# Altium schematic sheet main.SchDoc
size A3; SheetNumber: 1; SheetTotal: 2
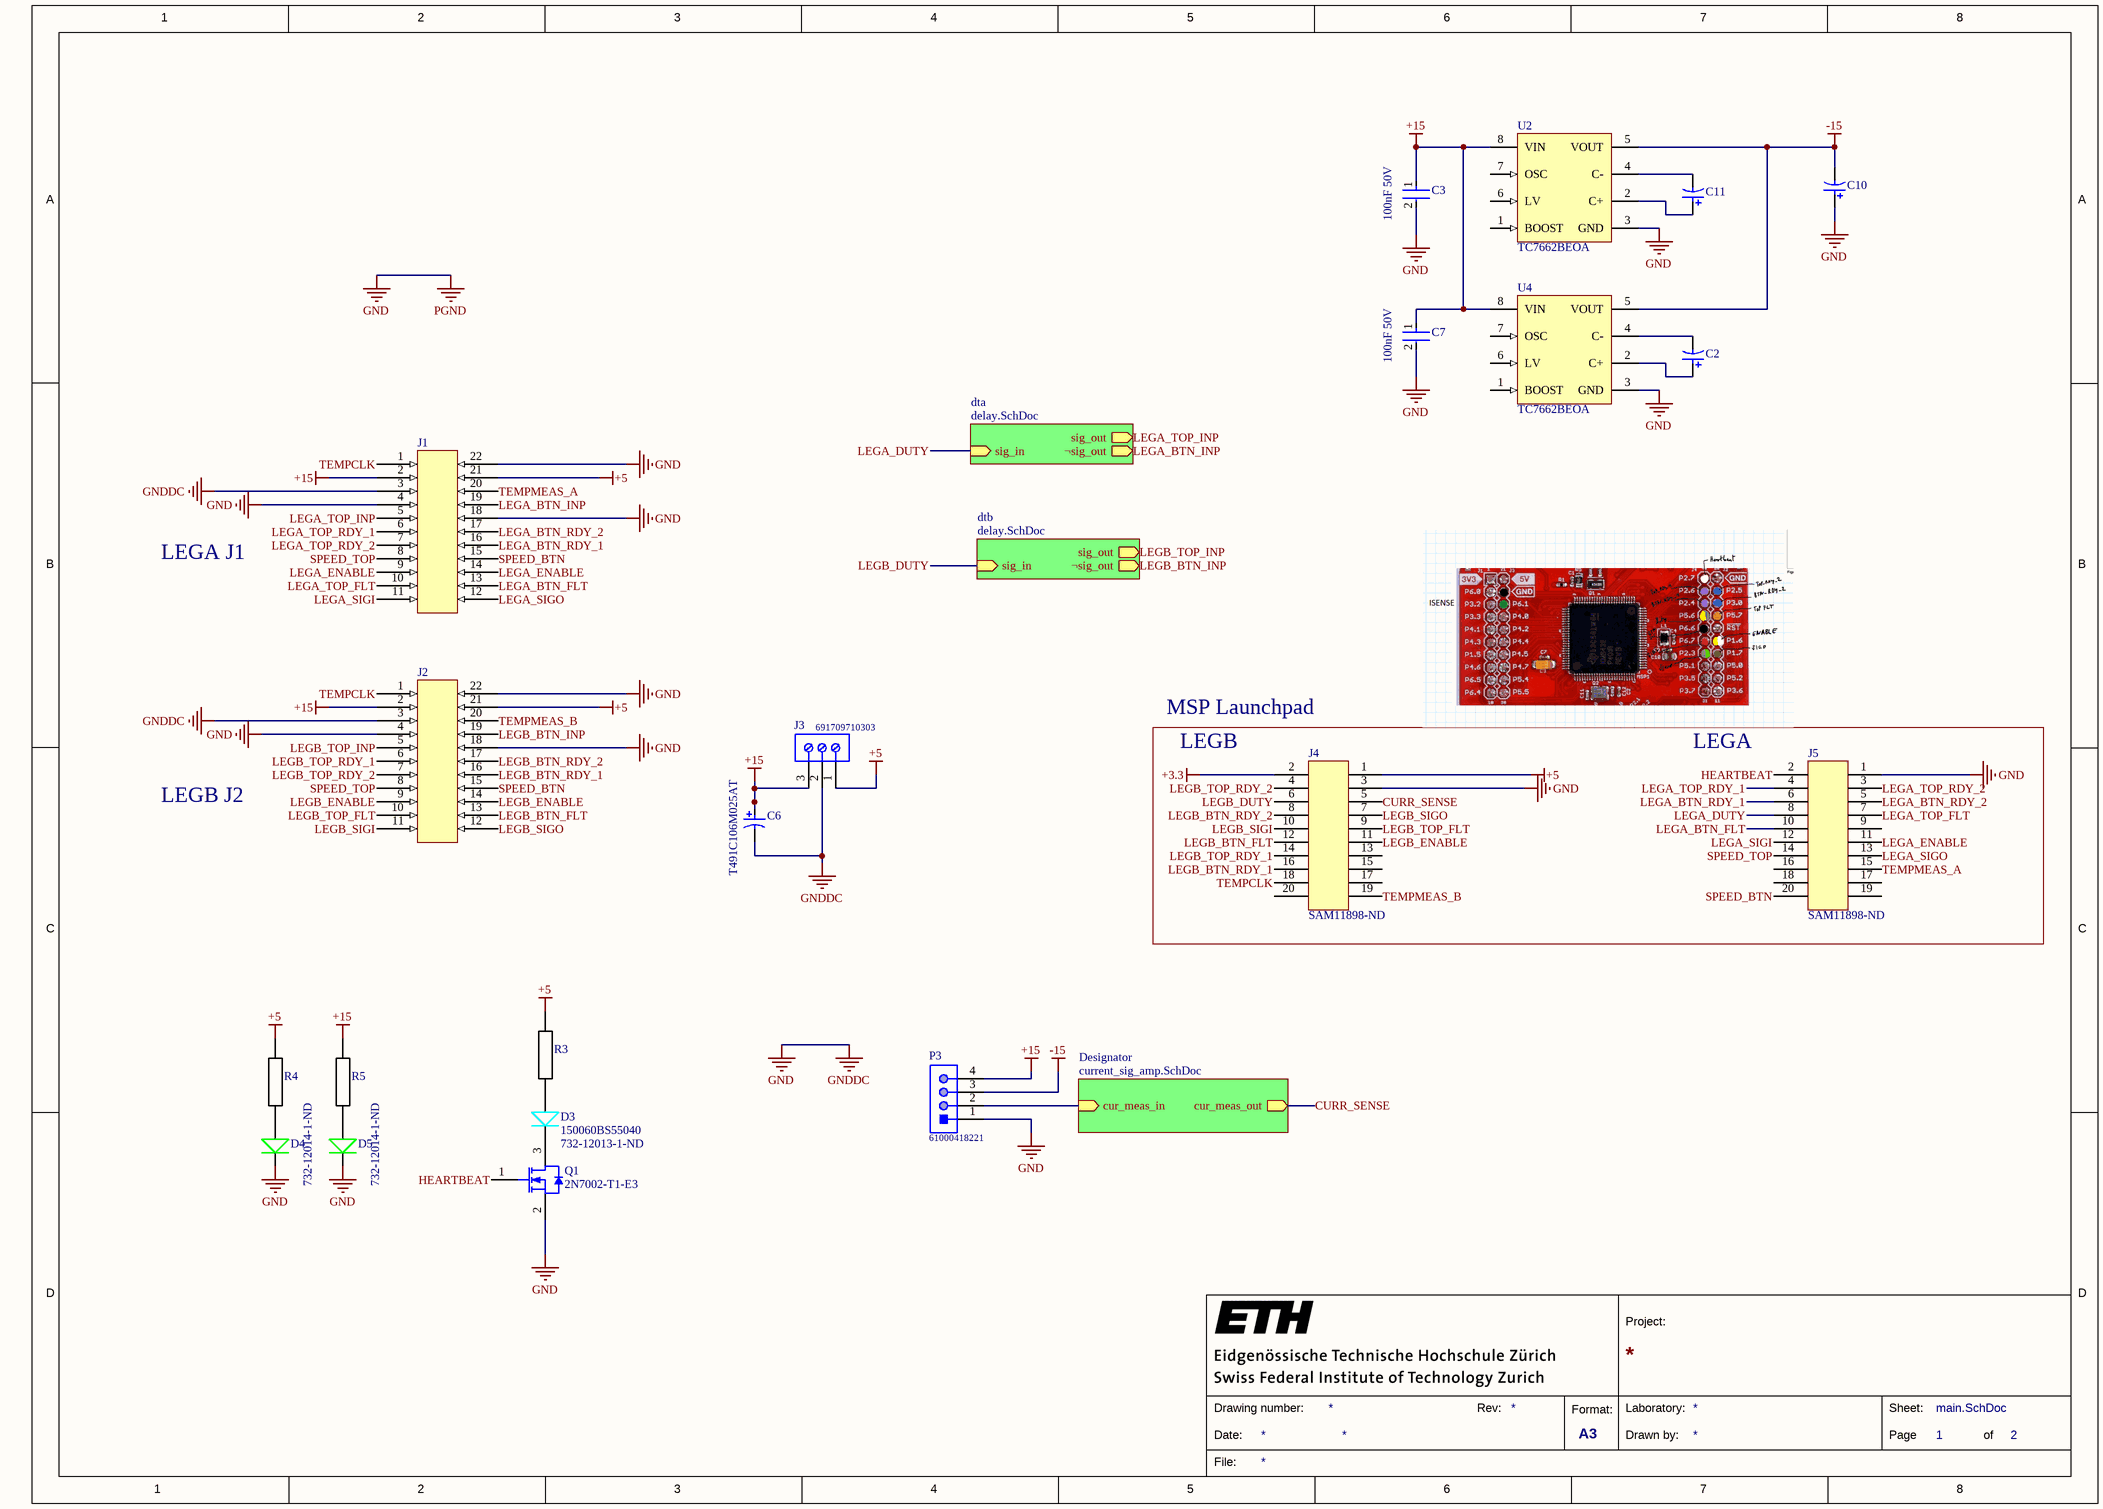
[diagram p0: main.SchDoc]

## Parts
C2  TPSD226M025R0200  [AVX-7343-31_L]  (value not drawn)
C3  100nF 50V  [FP-CGA3E-0_3-0_1-IPC_A]
C6  T491C106M025AT  [KEMT-T491-C_L]
C7  100nF 50V  [FP-CGA3E-0_3-0_1-IPC_A]
C10  TPSD226M025R0200  [AVX-7343-31_L]  (value not drawn)
C11  TPSD226M025R0200  [AVX-7343-31_L]  (value not drawn)
D3  150060BS55040  Supplier Part Number 1: 732-12013-1-ND  [LED_BLUE_0603]
D4  732-12014-1-ND  [LED_GREEN_0603]
D5  732-12014-1-ND  [LED_GREEN_0603]
J1  header_22_milligrid  [header_22_milligrid]  (value not drawn)
J2  header_22_milligrid  [header_22_milligrid]  (value not drawn)
J3  691709710303  [691709710303]
J4  Supplier Part Number 1: SAM11898-ND  [header_f_20_imp]  (hidden comment: header_f_20_imp)
J5  Supplier Part Number 1: SAM11898-ND  [header_f_20_imp]  (hidden comment: header_f_20_imp)
P3  61000418221  [61000418221]
Q1  2N7002-T1-E3  [VISH-TO-236-3_A_L]
R3  res_smd  [0805]  (value not drawn)
R4  res_smd  [0805]  (value not drawn)
R5  res_smd  [0805]  (value not drawn)
U2  TC7662BEOA  [SOIC-OA8_M]
U4  TC7662BEOA  [SOIC-OA8_M]

## Sub-sheets
Designator = current_sig_amp.SchDoc: cur_meas_in (in), cur_meas_out (out)
dta = delay.SchDoc: sig_out (out), ¬sig_out (out), sig_in (in)
dtb = delay.SchDoc: sig_out (out), ¬sig_out (out), sig_in (in)

## Nets
+3.3: J4.2
+5: J1.21 J2.21 J3.1 J4.1 R3.1 R4.1
+15: C3.1 C6.1 C7.1 J1.2 J2.2 J3.3 P3.4 R5.1 U2.8(VIN) U4.8(VIN)
-15: C10.2 P3.3 U2.5(VOUT) U4.5(VOUT)
GND: C3.2 C6.2 C7.2 C10.1 D4.C D5.C J1.3 J1.4 J1.18 J1.22 J2.3 J2.4 J2.18 J2.22 J3.2 J4.3 J5.1 P3.1 Q1.2(S) U2.3(GND) U4.3(GND)  [also labelled GNDDC, PGND]
CURR_SENSE: J4.5 ; sheet Designator/cur_meas_out
HEARTBEAT: J5.2 Q1.1(G)
LEGA_BTN_FLT: J1.13 J5.10
LEGA_BTN_INP: J1.19 ; sheet dta/¬sig_out
LEGA_BTN_RDY_1: J1.16 J5.6
LEGA_BTN_RDY_2: J1.17 J5.5
LEGA_DUTY: J5.8 ; sheet dta/sig_in
LEGA_ENABLE: J1.9 J1.14 J5.11
LEGA_SIGI: J1.11 J5.12
LEGA_SIGO: J1.12 J5.13
LEGA_TOP_FLT: J1.10 J5.7
LEGA_TOP_INP: J1.5 ; sheet dta/sig_out
LEGA_TOP_RDY_1: J1.6 J5.4
LEGA_TOP_RDY_2: J1.7 J5.3
LEGB_BTN_FLT: J2.13 J4.12
LEGB_BTN_INP: J2.19 ; sheet dtb/¬sig_out
LEGB_BTN_RDY_1: J2.16 J4.16
LEGB_BTN_RDY_2: J2.17 J4.8
LEGB_DUTY: J4.6 ; sheet dtb/sig_in
LEGB_ENABLE: J2.9 J2.14 J4.11
LEGB_SIGI: J2.11 J4.10
LEGB_SIGO: J2.12 J4.7
LEGB_TOP_FLT: J2.10 J4.9
LEGB_TOP_INP: J2.5 ; sheet dtb/sig_out
LEGB_TOP_RDY_1: J2.6 J4.14
LEGB_TOP_RDY_2: J2.7 J4.4
SPEED_BTN: J1.15 J2.15 J5.20
SPEED_TOP: J1.8 J2.8 J5.14
TEMPCLK: J1.1 J2.1 J4.18
TEMPMEAS_A: J1.20 J5.15
TEMPMEAS_B: J2.20 J4.19
NetC2_1: C2.1 U4.2(C+)
NetC2_2: C2.2 U4.4(C-)
NetC11_1: C11.1 U2.2(C+)
NetC11_2: C11.2 U2.4(C-)
NetD3_A: D3.A R3.2
NetD3_C: D3.C Q1.3(D)
NetD4_A: D4.A R4.2
NetD5_A: D5.A R5.2
NetP3_2: P3.2 ; sheet Designator/cur_meas_in

Not connected (* = marked no-connect by the designer): J4 13 15 17 20; J5 9 16 17 18 19; U2 1(BOOST) 6(LV) 7(OSC); U4 1(BOOST) 6(LV) 7(OSC)

## Notes on the sheet
- LEGA J1
- MSP Launchpad
- LEGB
- LEGA
- LEGB J2
- 1
- 2
- 3
- 4
- 5
- 6
- 7
- 8
- A
- B
- C
- D
- Project:
- Date:
- Drawing number:
- Rev:
- Format:
- A3
- Drawn by:
- Laboratory:
- Page
- Sheet:
- of
- File:

## Library data of the parts
C2 C10 C11 = CMP-2000-07302-1: Tantalum Capacitor, 22 uF, +/- 20%, 25 V, -55 to 125 degC, 2-Pin SMD, RoHS, Tape and Reel; Manufacturer Size Code: D; Manufacturer: AVX; Other Names: 478-4106-6; Online Catalog: TPSSeries; ESR (Equivalent Series Resistance): 200mOhm; Voltage - Rated: 25V; Product Training Modules: ComponentSolutionsforSmartMeterApplications; Capacitance: 22µF; Featured Product: TPSCapacitors; Type: Molded; Package / Case: 2917(7343Metric); Size / Dimension: 0.287"Lx0.169"W(7.30mmx4.30mm); Standard Package: 1; Mounting Technology: SurfaceMount; Packaging: Digi-Reel®; Series: TPS; Category: Capacitors; Datasheet URL: https://datasheet.ciiva.com/11793/0900766b80066cb4-11793194.pdf; Tolerance: ±20%; Features: GeneralPurpose; Package Reference: 7343-31; Mounting Type: SurfaceMount; Operating Temperature: -55°C~125°C; Height - Seated (Max): 0.122"(3.10mm); Lead Spacing: -; Lifetime @ Temp.: -; Family: TantalumCapacitors; Manufacturer URL: http://www.avx.com/; Package Description: 2-Pin Surface Mount Device, Body 7.3 x 4.35 mm; Datasheet Version: 02/2004
C3 C7 = CMP-2000-07546-2: Cap Ceramic 100nF 50V X7R 10% Pad SMD 0603 +125°C Automotive T/R; Weight: 7.1E-05oz; Composition: Ceramic; Max Operating Temperature: 125°C; Termination: SMD/SMT; Dielectric: X7R; Length: 1.6mm; Package Quantity: 1; REACH SVHC: No SVHC; Lead Free: Lead Free; Case Code (Metric): 1608; Min Operating Temperature: -55°C; Packaging: Tape and Reel; Tolerance: 10%; Voltage Rating: 50V; Case Code (Imperial): 0603; Capacitance: 100nF; Case/Package: 0603; Voltage Rating (DC): 50V; Depth: 0.8mm; Radiation Hardening: No; Ratings: AEC-Q200; Mount: Surface Mount; Voltage: 50V; Thickness: 0.035inch; Width: 0.8mm; Height: 0.8mm
C6 = CMP-2000-07199-1: Tantalum Surface Mount Capacitor, 10 uF, +/- 20%, 25 V, -55 to 125 degC, 2-Pin SMD, RoHS, Tape and Reel; Manufacturer: Kemet; Product Diameter (mm): NotRequiredmm; Rad Hardened: No; Seal: NotRequired; Product Depth (mm): 3.2mm; ESR: 1.5ohm; Product Length (mm): 6mm; Voltage: 25VDC; DF: 6%; Product Height (mm): 2.5mm; Capacitance: 10000000pF; Polarity: Polar; Case Style: Molded; DCL: 2.5uA; Package Description: 2-Pin Surface Mount Device, Body 6 x 3.2 mm; Case Code: C; Length W/Weld: NotRequiredmm; Length W/Weld (max): NotRequiredmm; Manufacturer URL: http://www.kemet.com/; Mounting Style: SurfaceMount; Tolerance (+ or -): 20%; Failure Rate: NotRequired; Package / Case: 6032-28; Seated Plane Height: NotRequiredmm; Construction: SMTChip; Operating Temp Range: -55Cto125C; Mounting Technology: SurfaceMount; Lead Spacing (nom): NotRequiredmm; Wire Form: NotRequired; Insulation: NotRequired; Datasheet Version: 06/2016; Package Reference: T491-C; Packaging: TapeandReel; Datasheet URL: http://www.kemet.com/Lists/ProductCatalog/Attachments/254/KEM_T2005_T491.pdf
D3 = led_blue_0603: Supplier 1: Digi-Key
D4 D5 = led_green_0603: Supplier 1: Digi-Key; Supplier Part Number 1: 732-12014-1-ND
J3 = CMP-1502-03336-1: Serie 7097 - 5.00 mm Horizontal Entry SMT with Pressure Clamp WR-TBL, 3 pin; Manufacturer: Wurth Elektronik; Pitch: 5.00mm; Pin Number: 3; Mounting Technology: SMT; Publisher: WurthElektronik; Package Reference: 691709710303; Packaging: TapeandReelwithCap; Part Number: 691709710303; Operating Temperature: -45to130degC; Datasheet URL: http://katalog.we-online.de/em/datasheet/6917097103xx.pdf; Manufacturer URL: http://www.we-online.de
P3 = CMP-1502-01019-1: SMT Vertical Pin Header WR-PHD, Pitch 2.54 mm, Single Row, 4 pins; Manufacturer: Wurth Elektronik; Rated Current: 3A; Gender: Male; Withstanding Voltage: 500VAC; Working Voltage: 250VAC; Pitch: 2.54mm; Pin Number: 4; Contact Resistance: 20mOhm; Mounting Technology: SMT; Packaging: Tube; Manufacturer URL: http://www.we-online.de; Row Number: Single; Operating Temperature: -40to125degC; Part Number: 61000418221; Publisher: WurthElektronik; Orientation: Vertical; Package Reference: 61000418221; Datasheet URL: https://katalog.we-online.de/em/datasheet/6100xx18221.pdf
Q1 = CMP-2000-05565-1: N-Channel MOSFET, 115 mA, 60 V, -55 to 150 degC, 3-Pin SOT23, RoHS, Tape and Reel; Manufacturer: Vishay; Continuous Drain Current Id: 115mA; Threshold Voltage Vgs: 2.1V; Transistor Case Style: TO-236; On Resistance Rds(on): 7.5ohm; Transistor Polarity: NChannel; Power Dissipation Pd: 200mW; No. of Pins: 3; SVHC: NoSVHC(17-Dec-2014); Drain Source Voltage Vds: 60V; Rds(on) Test Voltage Vgs: 10V; Package URL: http://www.vishay.com/docs/71196/71196.pdf; Package Description: 3-Pin Small Outline Transistor, Body 2.92 x 1.3 mm, Pitch 0.95 mm; Datasheet URL: http://www.vishay.com/docs/70226/70226.pdf; Package Reference: TO-236-3; MSL: MSL1-Unlimited; Mounting Technology: SurfaceMount; Operating Temperature Max: 150°C; Datasheet Version: Rev. F, 07/2001; Manufacturer URL: http://www.vishay.com/
U2 U4 = CMP-0132-00036-1: Charge Pump DC-to-DC Voltage Converter, 10kHz, 35kHz, 8-Pin SOIC 150mil, Industrial Temperature; PackageReference: SOIC-OA8; Code_IPC: SOIC127P600-8; PackageDescription: 8-Lead Plastic Small Outline (OA) - Narrow, 3.90mm Body [SOIC]; PackageVersion: revBB, Aug-2009; DatasheetVersion: revA, Oct-2002
J1 J2 = header_22_milligrid: Supplier 1: Digi-Key; Supplier Part Number 1: 23-0877592250-ND
J4 J5 = header_f_20_imp: Supplier 1: Digi-Key